# EAGLE schematic main (EAGLE 7.5.0)
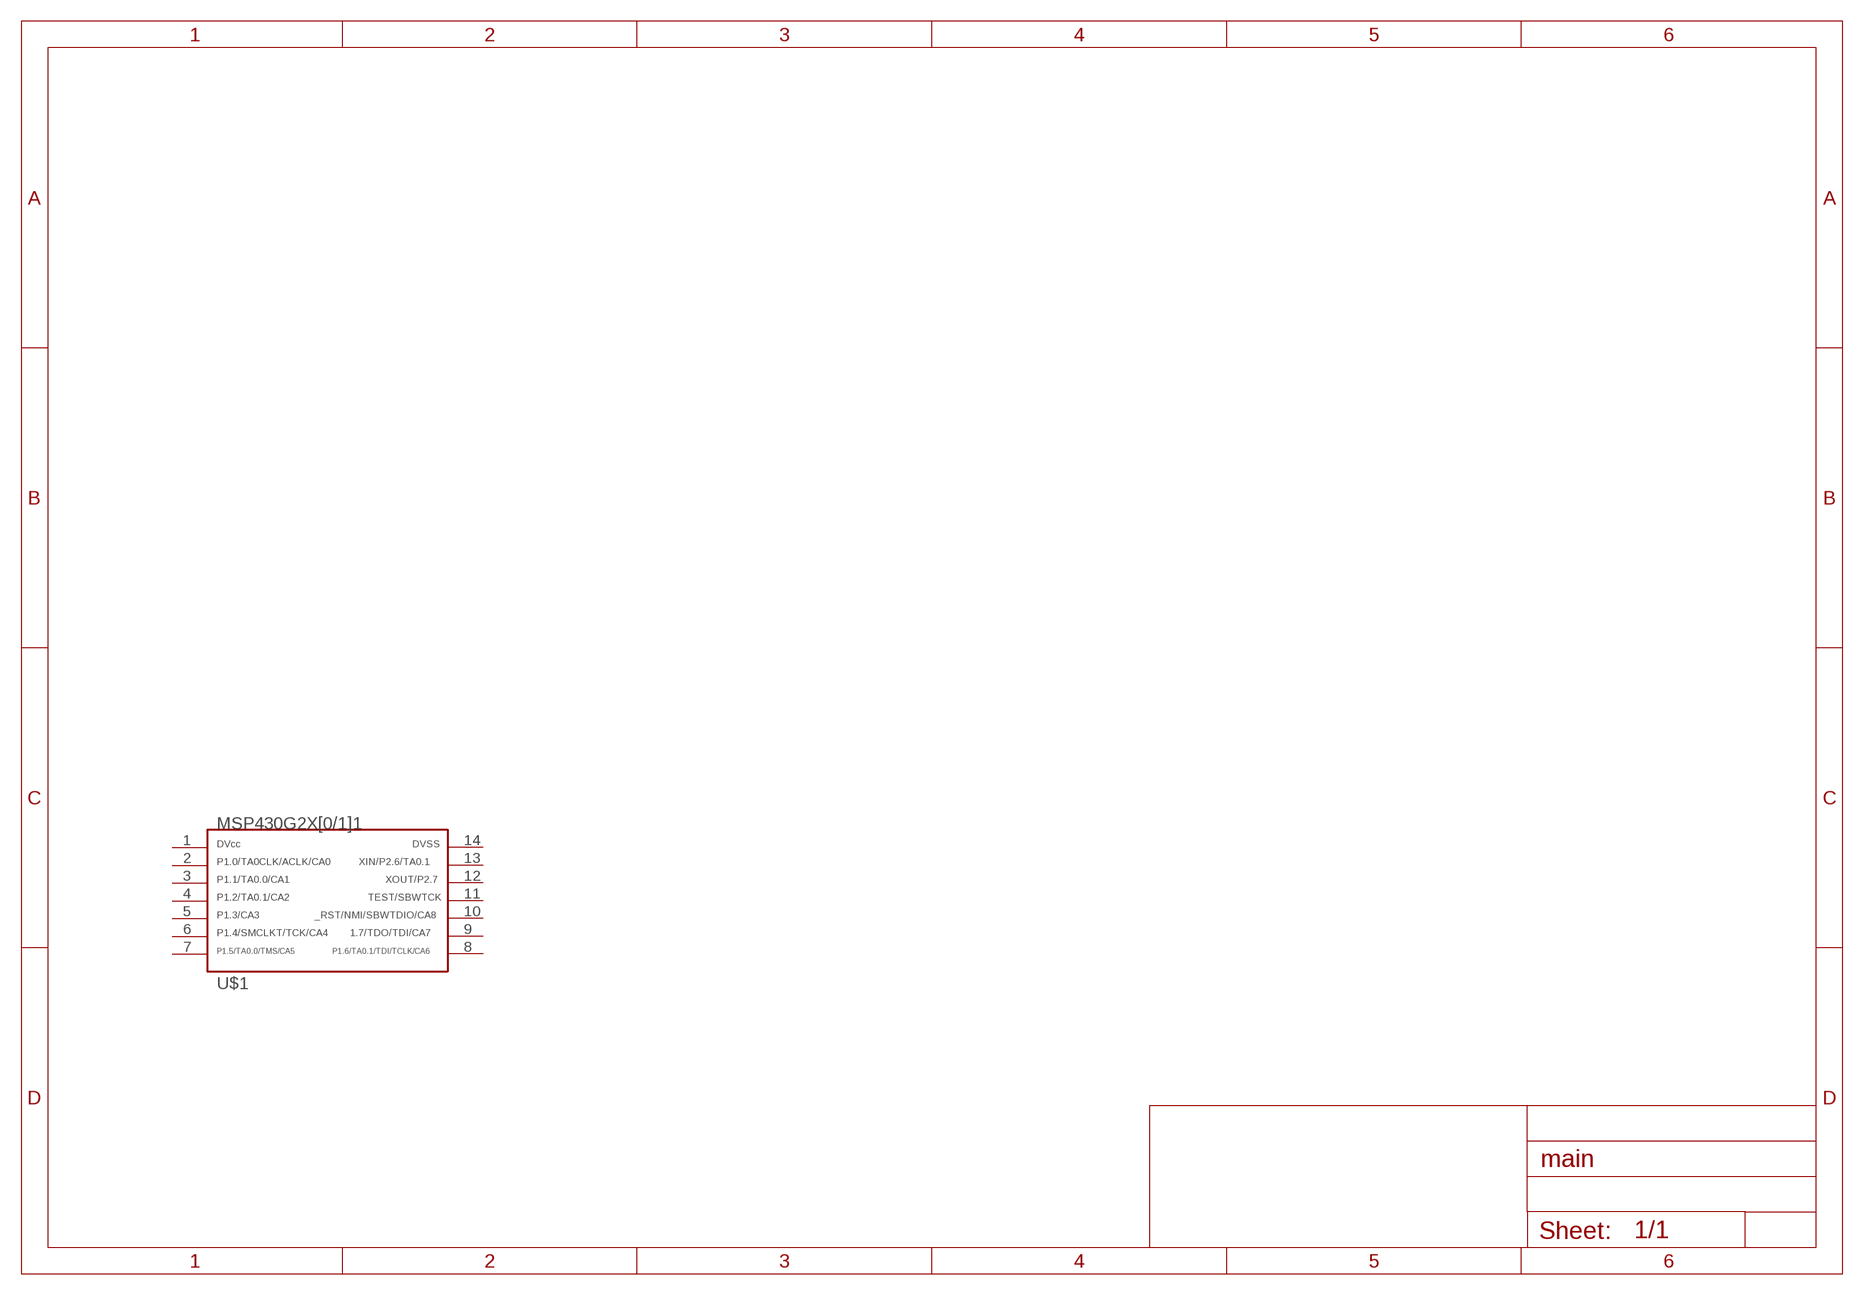
[diagram p0: schematic, sheet 1]

## Parts
U$1  G2X[0/1]1---N14  [N14]
Unconnected: U$1.1 U$1.2 U$1.3 U$1.4 U$1.5 U$1.6 U$1.7 U$1.8 U$1.9 U$1.10 U$1.11 U$1.12 U$1.13 U$1.14

## Library data of the parts
U$1 = component_library:G2X[0/1]1---N14: MSP430G2X[0/1]1 MSP430G2001, MSP430G2101, MSP430G2201,MSP430G2111, G2211 PDIP (N) 14 Pin Package http://focus.ti.com/docs/prod/folders/print/msp430g2111.html